# EAGLE design control-tu55 (EAGLE 5.07)

## Sheet 1 of 2
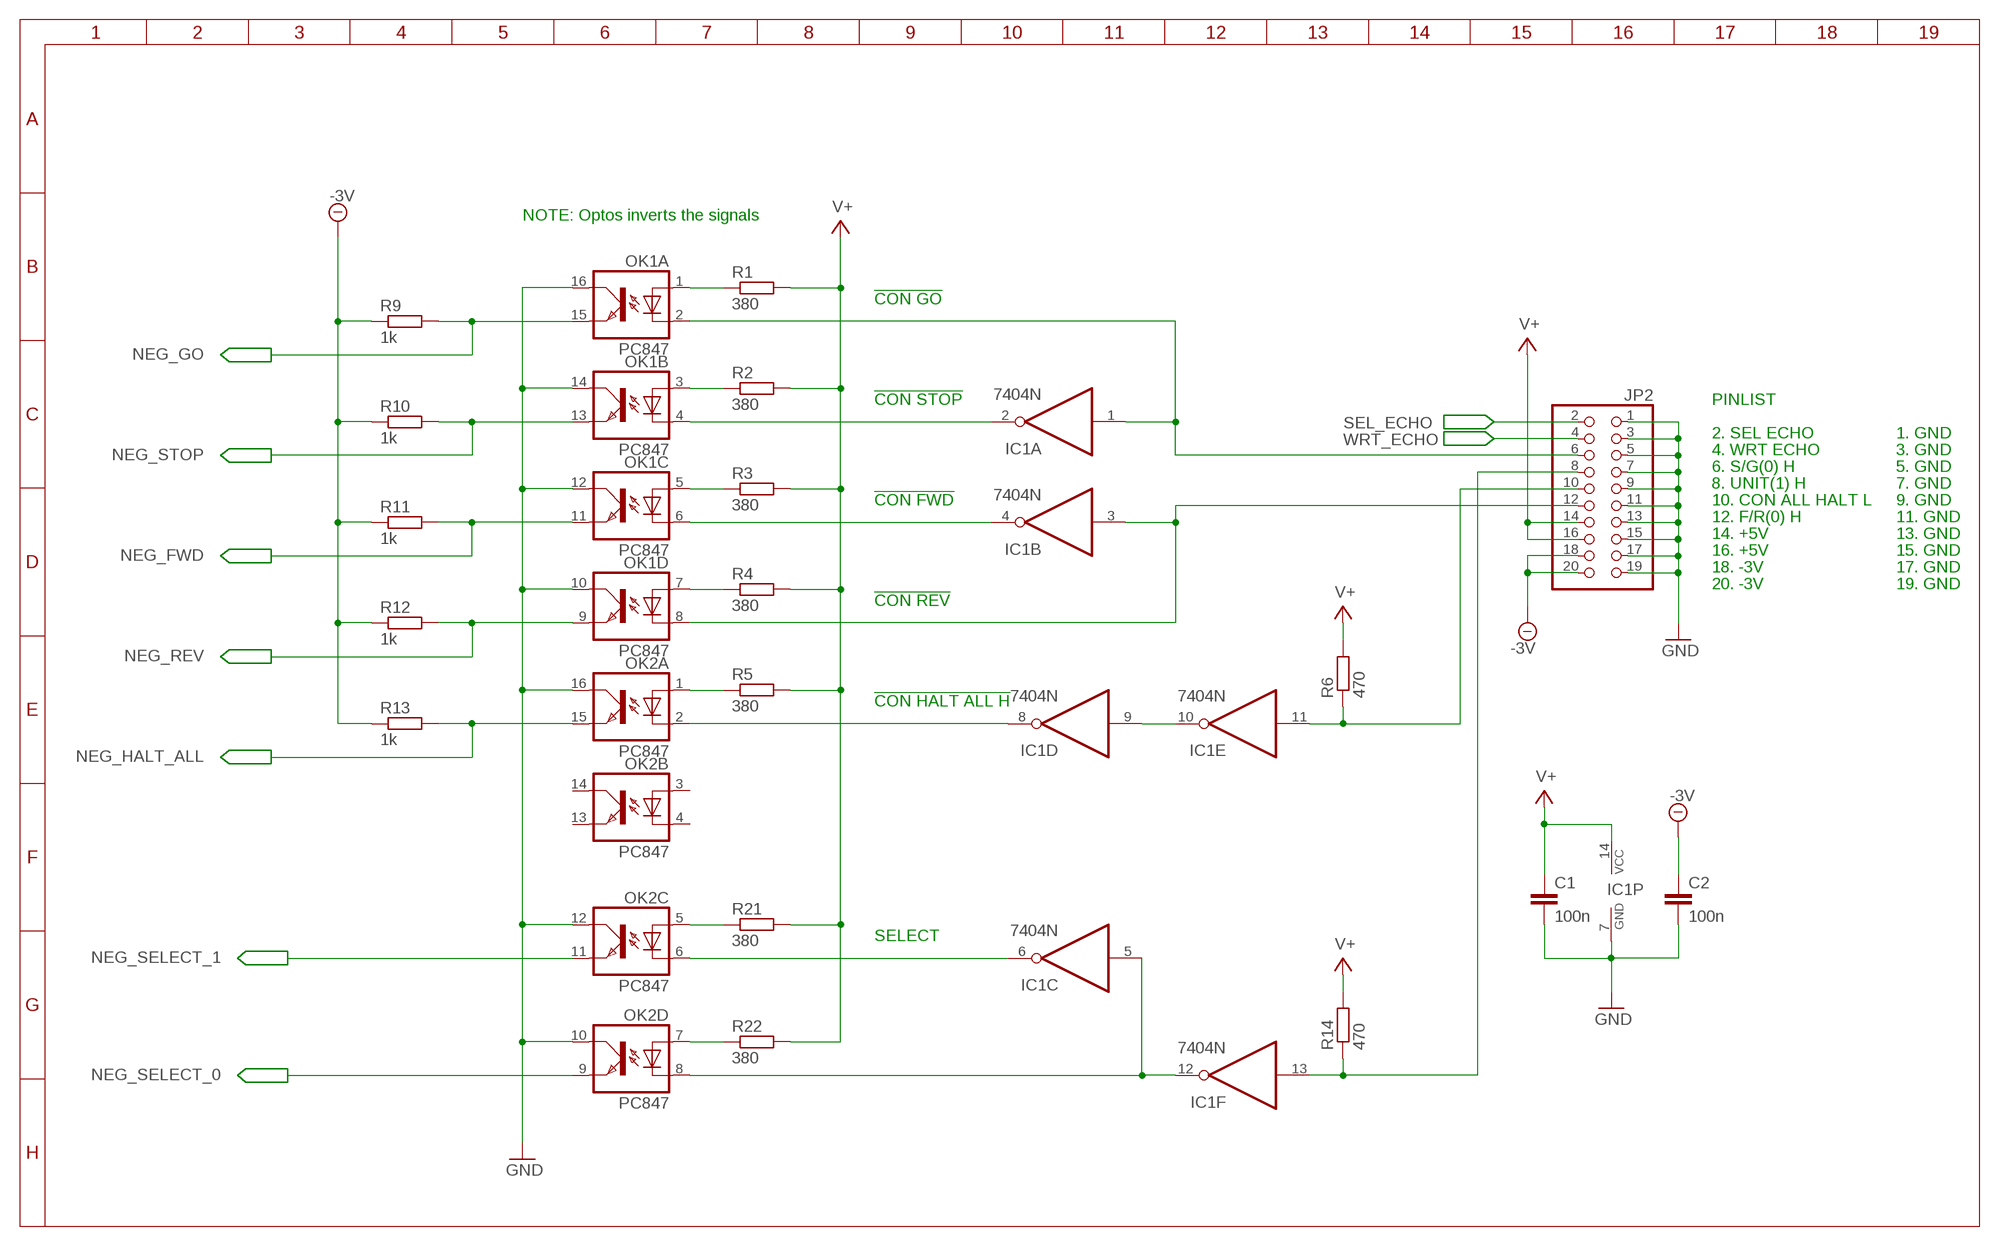
[diagram p0: schematic, sheet 1]

### Parts
C1  100n  C5/3.5  [C5B3.5]
C2  100n  C5/3.5  [C5B3.5]
IC1  7404N  [DIL14]
JP2  PINHD-2X10/90-FRAMED  [2Z10/90-FRAMED]
OK1  PC847  [DIL16]
OK2  PC847  [DIL16]
R1  380  R-EU_0207/10  [0207/10]
R2  380  R-EU_0207/10  [0207/10]
R3  380  R-EU_0207/10  [0207/10]
R4  380  R-EU_0207/10  [0207/10]
R5  380  R-EU_0207/10  [0207/10]
R6  470  R-EU_0207/10  [0207/10]
R9  1k  R-EU_0207/10  [0207/10]
R10  1k  R-EU_0207/10  [0207/10]
R11  1k  R-EU_0207/10  [0207/10]
R12  1k  R-EU_0207/10  [0207/10]
R13  1k  R-EU_0207/10  [0207/10]
R14  470  R-EU_0207/10  [0207/10]
R21  380  R-EU_0207/10  [0207/10]
R22  380  R-EU_0207/10  [0207/10]

### Nets
-3V: C2.1 JP2.18 JP2.20 R9.1 R10.1 R11.1 R12.1 R13.1 ; also sheet 2
GND: C1.2 C2.2 IC1.7(P:GND) JP2.1 JP2.3 JP2.5 JP2.7 JP2.9 JP2.11 JP2.13 JP2.15 JP2.17 JP2.19 OK1.10(D:COL) OK1.12(C:COL) OK1.14(B:COL) OK1.16(A:COL) OK2.10(D:COL) OK2.12(C:COL) OK2.16(A:COL)
N$1: IC1.9(D:I) IC1.10(E:O)
N$2: IC1.8(D:O) OK2.2(A:C)
N$3: IC1.5(C:I) IC1.12(F:O) OK2.8(D:C)
N$4: IC1.11(E:I) JP2.10 R6.1
N$10: IC1.1(A:I) JP2.6 OK1.2(A:C)
N$11: IC1.2(A:O) OK1.4(B:C)
N$15: IC1.13(F:I) JP2.8 R14.1
N$23: IC1.4(B:O) OK1.6(C:C)
N$25: OK2.5(C:A) R21.1
N$26: OK2.7(D:A) R22.1
N$27: IC1.3(B:I) JP2.12 OK1.8(D:C)
N$28: OK2.1(A:A) R5.1
N$29: OK1.7(D:A) R4.1
N$30: OK1.5(C:A) R3.1
N$31: OK1.3(B:A) R2.1
N$32: OK1.1(A:A) R1.1
N$33: IC1.6(C:O) OK2.6(C:C)
NEG_FWD: OK1.11(C:EMIT) R11.2 ; also sheet 2
NEG_GO: OK1.15(A:EMIT) R9.2 ; also sheet 2
NEG_HALT_ALL: OK2.15(A:EMIT) R13.2 ; also sheet 2
NEG_REV: OK1.9(D:EMIT) R12.2 ; also sheet 2
NEG_SELECT_0: OK2.9(D:EMIT) ; also sheet 2
NEG_SELECT_1: OK2.11(C:EMIT) ; also sheet 2
NEG_STOP: OK1.13(B:EMIT) R10.2 ; also sheet 2
SEL_ECHO: JP2.2 ; also sheet 2
V+: C1.1 IC1.14(P:VCC) JP2.14 JP2.16 R1.2 R2.2 R3.2 R4.2 R5.2 R6.2 R14.2 R21.2 R22.2
WRT_ECHO: JP2.4 ; also sheet 2
Unconnected: OK2.3(B:A) OK2.4(B:C) OK2.13(B:EMIT) OK2.14(B:COL)

### Notes on the sheet
- NOTE: Optos inverts the signals
- !CON GO
- !CON STOP | PINLIST
- 2. SEL ECHO | 1. GND
- 4. WRT ECHO | 3. GND
- 6. S/G(0) H | 5. GND
- 8. UNIT(1) H | 7. GND
- !CON FWD | 10. CON ALL HALT L | 9. GND
- 12. F/R(0) H | 11. GND
- 14. +5V | 13. GND
- 16. +5V | 15. GND
- 18. -3V | 17. GND
- 20. -3V | 19. GND
- !CON REV
- !CON HALT ALL H
- SELECT

## Sheet 2 of 2
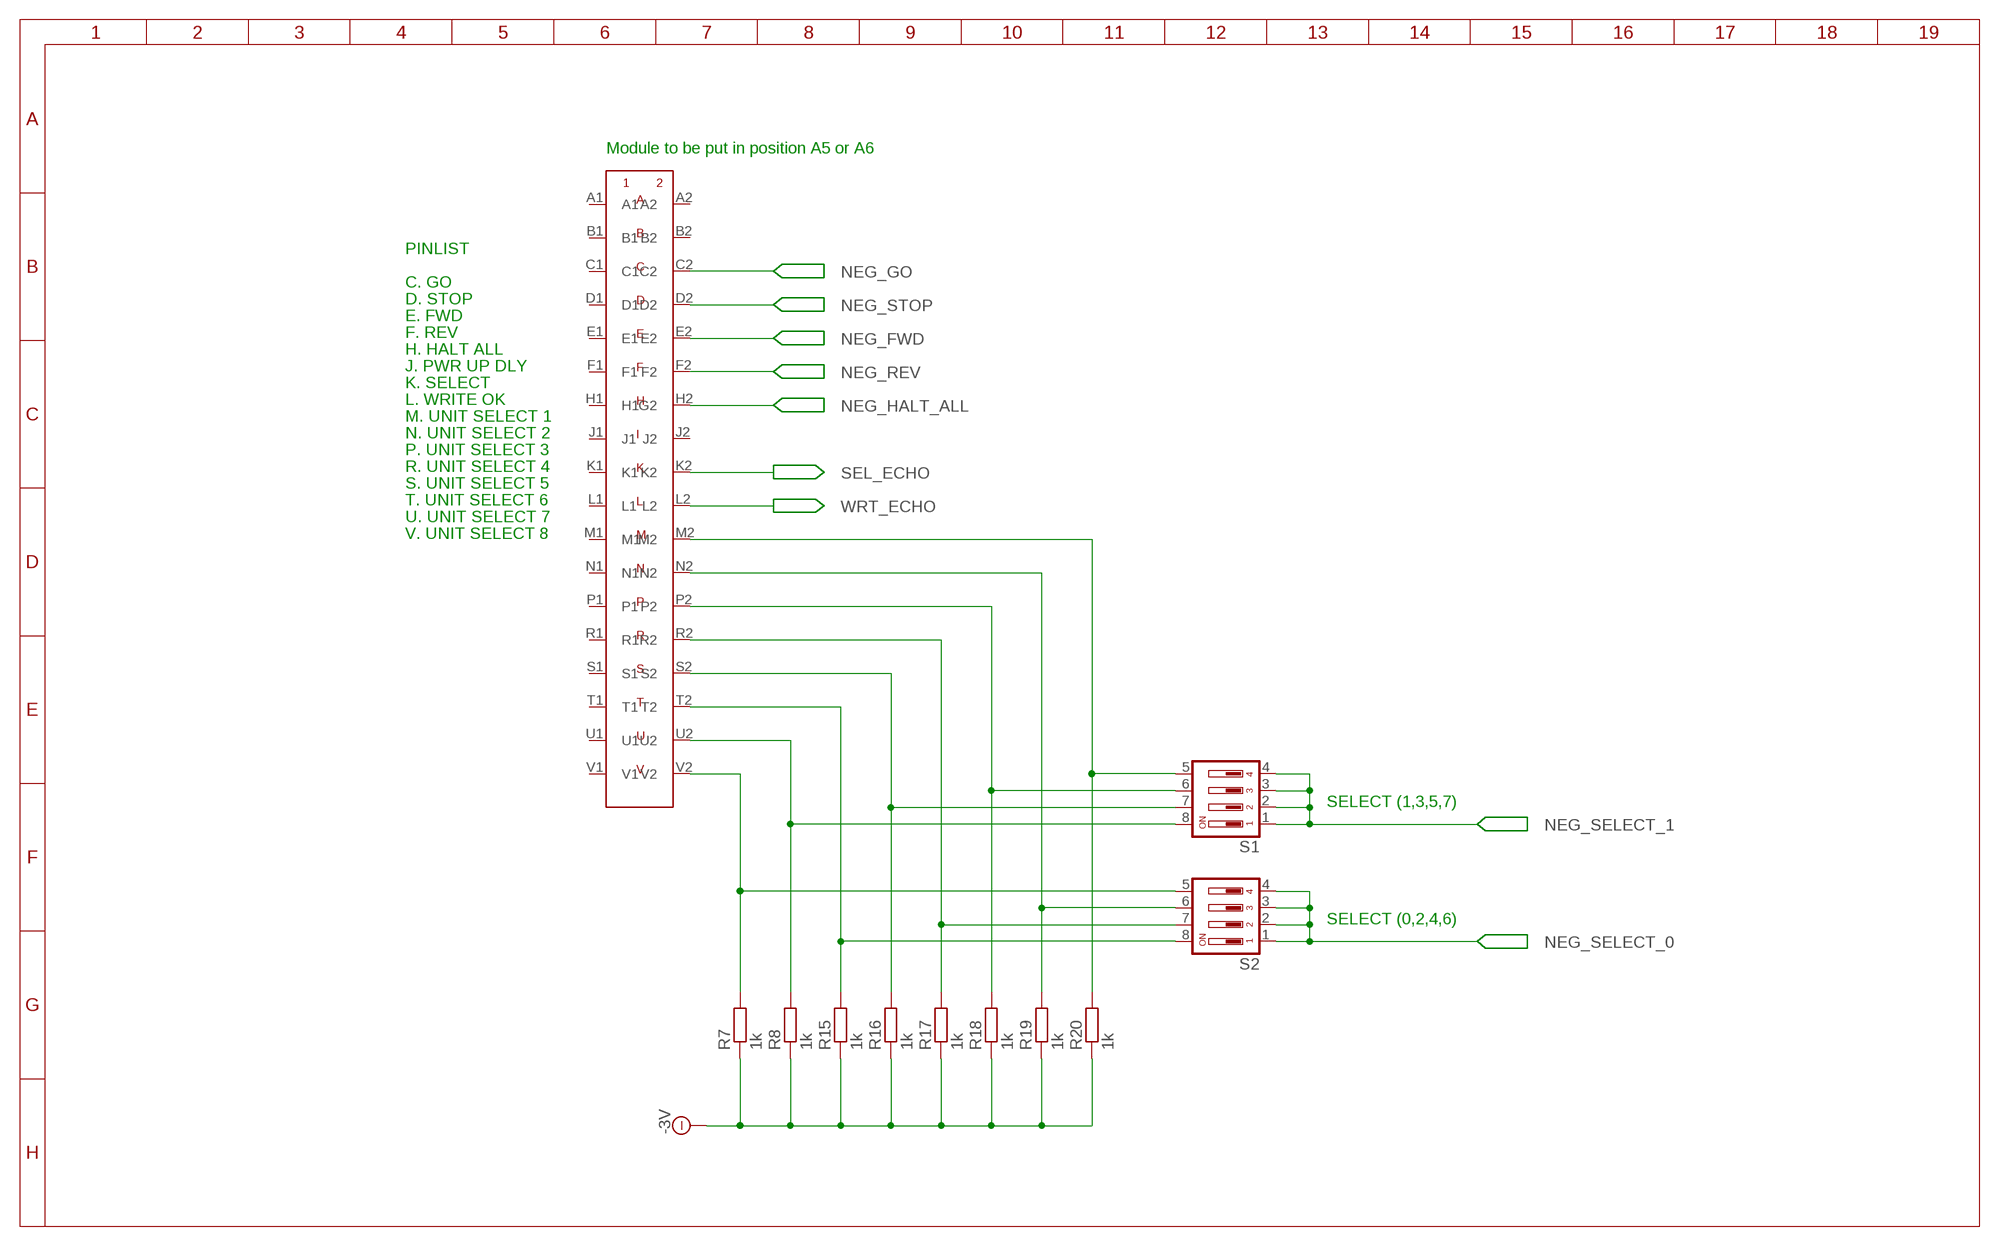
[diagram p1: schematic, sheet 2]

### Parts
CON1  FLIPCHIP_1NORMAL  [FLIPCHIP-1]
R7  1k  R-EU_0207/10  [0207/10]
R8  1k  R-EU_0207/10  [0207/10]
R15  1k  R-EU_0207/10  [0207/10]
R16  1k  R-EU_0207/10  [0207/10]
R17  1k  R-EU_0207/10  [0207/10]
R18  1k  R-EU_0207/10  [0207/10]
R19  1k  R-EU_0207/10  [0207/10]
R20  1k  R-EU_0207/10  [0207/10]
S1  DIP04YL  [DIP04YL]
S2  DIP04YL  [DIP04YL]

### Nets
-3V: R7.1 R8.1 R15.1 R16.1 R17.1 R18.1 R19.1 R20.1 ; also sheet 1
N$5: CON1.R2 R17.2 S2.7
N$6: CON1.T2 R15.2 S2.8
N$7: CON1.M2 R20.2 S1.5
N$8: CON1.V2 R7.2 S2.5
N$13: CON1.P2 R18.2 S1.6
N$14: CON1.N2 R19.2 S2.6
N$17: CON1.S2 R16.2 S1.7
N$20: CON1.U2 R8.2 S1.8
NEG_FWD: CON1.E2 ; also sheet 1
NEG_GO: CON1.C2 ; also sheet 1
NEG_HALT_ALL: CON1.H2(G2) ; also sheet 1
NEG_REV: CON1.F2 ; also sheet 1
NEG_SELECT_0: S2.1 S2.2 S2.3 S2.4 ; also sheet 1
NEG_SELECT_1: S1.1 S1.2 S1.3 S1.4 ; also sheet 1
NEG_STOP: CON1.D2 ; also sheet 1
SEL_ECHO: CON1.K2 ; also sheet 1
WRT_ECHO: CON1.L2 ; also sheet 1
Unconnected: CON1.A1 CON1.A2 CON1.B1 CON1.B2 CON1.C1 CON1.D1 CON1.E1 CON1.F1 CON1.H1 CON1.J1 CON1.J2 CON1.K1 CON1.L1 CON1.M1 CON1.N1 CON1.P1 CON1.R1 CON1.S1 CON1.T1 CON1.U1 CON1.V1

### Notes on the sheet
- Module to be put in position A5 or A6
- PINLIST
- C. GO
- D. STOP
- E. FWD
- F. REV
- H. HALT ALL
- J. PWR UP DLY
- K. SELECT
- L. WRITE OK
- M. UNIT SELECT 1
- N. UNIT SELECT 2
- P. UNIT SELECT 3
- R. UNIT SELECT 4
- S. UNIT SELECT 5
- T. UNIT SELECT 6
- U. UNIT SELECT 7
- V. UNIT SELECT 8
- SELECT (1,3,5,7)
- SELECT (0,2,4,6)

## Library data of the parts
C1 C2 = anders:C: CAPACITOR naming: grid - package width
CON1 = anders:FLIPCHIP_1: DEC Digital equipment single flipchip
IC1 = 74xx-eu:74*04: Hex INVERTER
JP2 = pinhead:PINHD-2X10: PIN HEADER
OK1 OK2 = optocoupler:PC847: SHARP OPTO COUPLER
R1-R22 = anders:R-EU_: RESISTOR, European symbol
S1 S2 = switch-dil:DIP04YL: DIL/CODE SWITCH

## Board
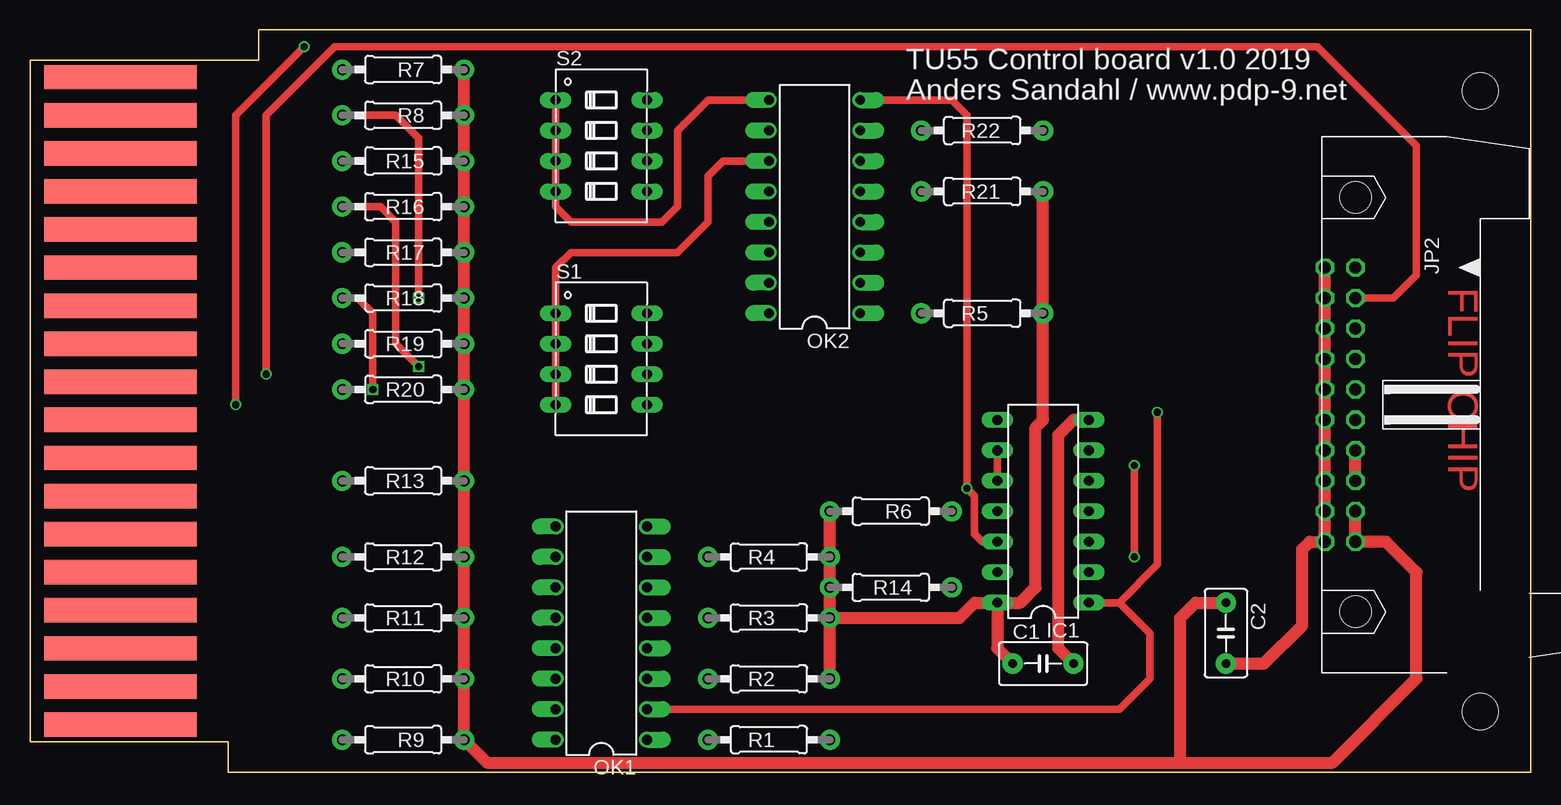
[diagram p2: board, top side]
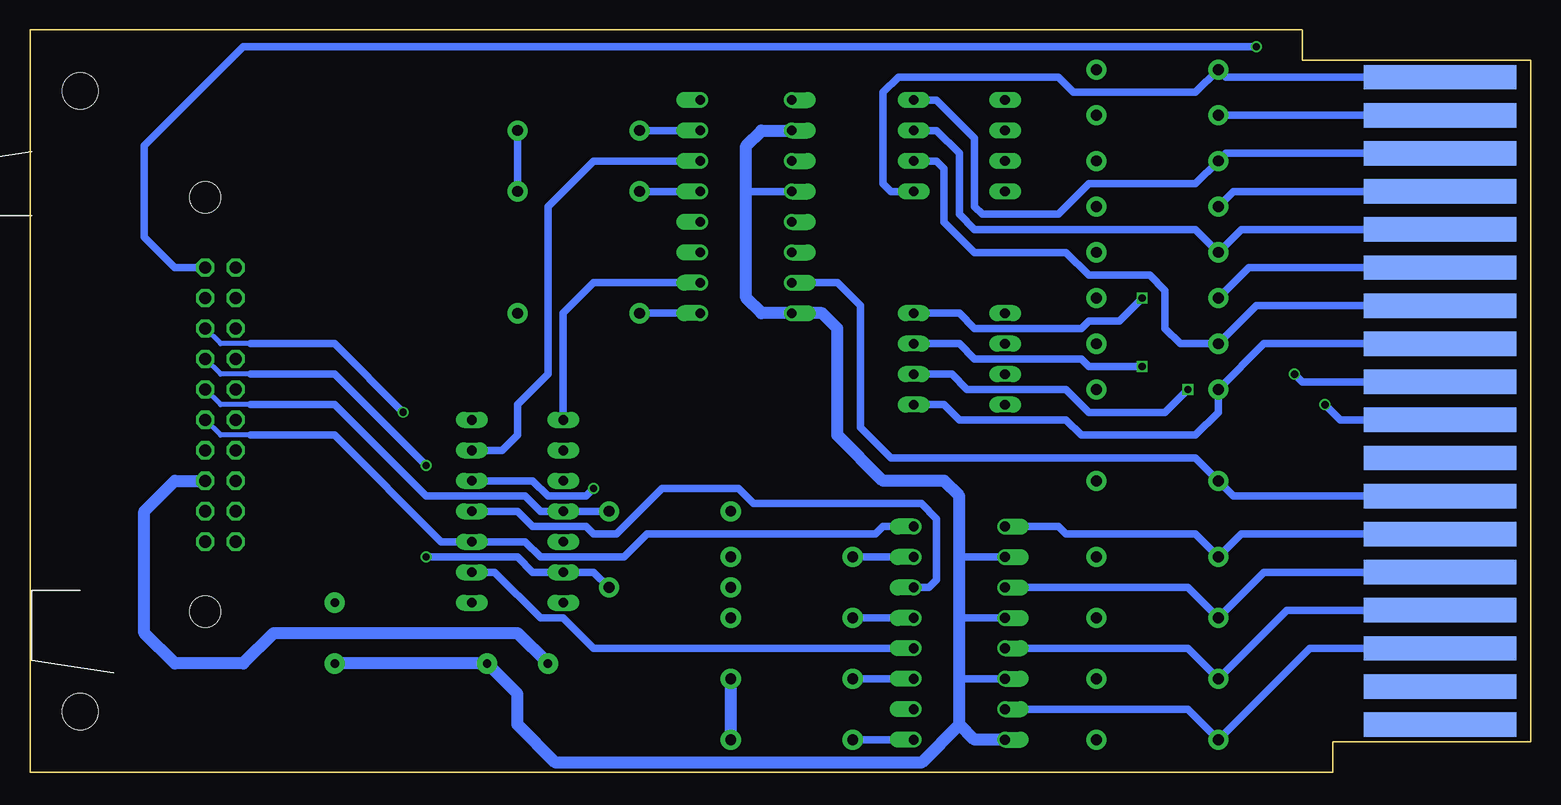
[diagram p3: board, bottom side, seen from below]

Size 125.09 x 61.91 mm. Coordinates in mm from the lower left corner, seen from the top.
Copper layers (1*16): Top 0.035mm / dielectric 1.5mm / Bottom 0.035mm
Design rules "SeeedStudio_2layer_DRU_no_angle_20140221": minimum track width 6mil, minimum drill 12mil, track to track 6mil, track to pad 6mil, pad to pad 6mil, via to via 6mil, smd to smd 0mil, copper to edge 10mil, drill to drill 10mil, minimum pad ring 10mil, minimum via ring 6mil, stop-mask expansion 2mil, vias tented up to drill 100mil, thermal gap 10mil

### Footprints (pad centres in the part's own frame; a part is rotated, then mirrored left to right if it is on the bottom)
C5B3.5 = drill 0.7 pad 1.676 round: 1 -2.54,0; 2 2.54,0
FLIPCHIP-1 = smd 12.7 x 2.032: A1 0.572,0; B1 0.572,3.175; C1 0.572,6.35; D1 0.572,9.525; E1 0.572,12.7; F1 0.572,15.875; H1 0.572,19.05; J1 0.572,22.225; K1 0.572,25.4; L1 0.572,28.575; M1 0.572,31.75; N1 0.572,34.925; P1 0.572,38.1; R1 0.572,41.275; S1 0.572,44.45; T1 0.572,47.625; U1 0.572,50.8; V1 0.572,53.975 | smd 12.7 x 2.032 bottom: A2 0.572,0; B2 0.572,3.175; C2 0.572,6.35; D2 0.572,9.525; E2 0.572,12.7; F2 0.572,15.875; H2 0.572,19.05; J2 0.572,22.225; K2 0.572,25.4; L2 0.572,28.575; M2 0.572,31.75; N2 0.572,34.925; P2 0.572,38.1; R2 0.572,41.275; S2 0.572,44.45; T2 0.572,47.625; U2 0.572,50.8; V2 0.572,53.975 | hole 3: 113.919,52.832; 113.919,1.079
DIL14 = drill 0.813 long: 1 -7.62,-3.81; 2 -5.08,-3.81; 3 -2.54,-3.81; 4 0,-3.81; 5 2.54,-3.81; 6 5.08,-3.81; 7 7.62,-3.81; 8 7.62,3.81; 9 5.08,3.81; 10 2.54,3.81; 11 0,3.81; 12 -2.54,3.81; 13 -5.08,3.81; 14 -7.62,3.81
2Z10/90-FRAMED = drill 1.016 octagon: 1 -11.43,-6.35; 2 -11.43,-3.81; 3 -8.89,-6.35; 4 -8.89,-3.81; 5 -6.35,-6.35; 6 -6.35,-3.81; 7 -3.81,-6.35; 8 -3.81,-3.81; 9 -1.27,-6.35; 10 -1.27,-3.81; 11 1.27,-6.35; 12 1.27,-3.81; 13 3.81,-6.35; 14 3.81,-3.81; 15 6.35,-6.35; 16 6.35,-3.81; 17 8.89,-6.35; 18 8.89,-3.81; 19 11.43,-6.35; 20 11.43,-3.81 | hole 2.6: 17.272,-3.81; -17.272,-3.81
DIL16 = drill 0.813 offset: 1 -8.89,-3.81; 2 -6.35,-3.81; 3 -3.81,-3.81; 4 -1.27,-3.81; 5 1.27,-3.81; 6 3.81,-3.81; 7 6.35,-3.81; 8 8.89,-3.81; 9 8.89,3.81; 10 6.35,3.81; 11 3.81,3.81; 12 1.27,3.81; 13 -1.27,3.81; 14 -3.81,3.81; 15 -6.35,3.81; 16 -8.89,3.81
0207/10 = drill 0.9 pad 1.676 round: 1 -5.08,0; 2 5.08,0
DIP04YL = drill 0.813 long: 1 -3.81,-3.81; 2 -1.27,-3.81; 3 1.27,-3.81; 4 3.81,-3.81; 5 3.81,3.81; 6 1.27,3.81; 7 -1.27,3.81; 8 -3.81,3.81

### Placement (x,y rotation side)
C1  84.45,9.08 0 top
C2  99.69,11.62 270 top
CON1  6.99,4 0 top
IC1  84.45,21.78 90 top
JP2  114.3,30.67 270 top
OK1  47.62,11.62 90 top
OK2  65.41,47.18 90 top
R1  61.59,2.73 0 top
R2  61.59,7.81 0 top
R3  61.59,12.89 0 top
R4  61.59,17.97 0 top
R5  79.38,38.29 0 top
R6  71.75,21.78 180 top
R7  31.12,58.61 180 top
R8  31.12,54.8 180 top
R9  31.12,2.73 180 top
R10  31.12,7.81 180 top
R11  31.12,12.89 180 top
R12  31.12,17.97 180 top
R13  31.12,24.32 180 top
R14  71.75,15.43 180 top
R15  31.12,50.99 180 top
R16  31.12,47.18 180 top
R17  31.12,43.37 180 top
R18  31.12,39.56 180 top
R19  31.12,35.75 180 top
R20  31.12,31.94 180 top
R21  79.38,48.45 0 top
R22  79.38,53.53 0 top
S1  47.62,34.48 270 top
S2  47.62,52.26 270 top

### Tracks (layer width: path | path; a pad name or v marks a point on that pad's centre or on a via)
-3V
  Top 0.61: R11.1 R10.1 R9.1
  Top 1.016: R7.1 R8.1 R15.1 R16.1 R17.1 R18.1 R19.1 R20.1 R13.1 R12.1 R11.1 R9.1 38.1,0.83 95.88,0.83 | 95.88,0.83 108.58,0.83 115.57,7.81 115.57,16.7 113.03,19.24 JP2.20 JP2.18 | C2.1 97.16,14.16 95.88,12.89 95.88,0.83
GND
  Top 0.61: 86.99,29.4 IC1.7
  Top 1.016: C1.2 85.72,10.35 85.72,28.13 86.99,29.4 | JP2.1 JP2.3 JP2.5 JP2.7 JP2.9 JP2.11 JP2.13 JP2.15 JP2.17 JP2.19 106.68,19.24 106.05,18.61 106.05,12.26 102.87,9.08 C2.2
  Bottom 0.61: 47.62,17.97 OK1.10 | 47.62,7.81 OK1.14 | 47.62,12.89 OK1.12 | 65.41,48.45 OK2.12
  Bottom 1.016: 47.62,4 47.62,7.81 47.62,12.89 47.62,17.97 47.62,23.05 48.9,24.32 53.98,24.32 57.79,28.13 57.79,37.02 59.05,38.29 OK2.16 64.13,38.29 65.41,39.56 65.41,48.45 65.41,52.26 64.13,53.53 OK2.10 | 47.62,4 46.36,2.73 OK1.16 | C2.2 C1.2 84.45,6.54 84.45,4 81.28,0.83 50.8,0.83 47.62,4
N$1
  Top 0.61: IC1.10 IC1.9
N$2
  Bottom 0.61: IC1.8 80.64,38.29 78.1,40.83 OK2.2
N$3  (via drill 0.6)
  Top 0.61: IC1.12 79.38,19.24 78.74,19.88 78.74,23.05 v78.1,23.69 78.1,54.8 76.83,56.07 OK2.8
  Bottom 0.61: IC1.5 83.18,24.32 81.91,23.05 78.74,23.05 v78.1,23.69
N$4
  Bottom 0.406: JP2.10 109.22,30.67 106.68,30.67 106.05,30.67
  Bottom 0.61: R6.1 IC1.11 82.55,21.78 83.82,23.05 92.07,23.05 99.69,30.67 106.68,30.67
N$5
  Bottom 0.61: CON1.R2 24.13,45.28 R17.2 27.94,45.28 46.36,45.28 47.62,46.55 47.62,51.63 49.53,53.53 S2.7
N$6
  Bottom 0.61: CON1.T2 25.4,51.63 R15.2 27.94,49.09 36.83,49.09 39.37,46.55 45.72,46.55 46.36,47.18 46.36,52.9 49.53,56.07 S2.8
N$7
  Bottom 0.61: CON1.M2 22.23,35.75 R20.2 26.04,30.04 27.94,28.13 37.47,28.13 38.73,29.4 47.62,29.4 48.9,30.67 S1.5
N$8
  Bottom 0.61: CON1.V2 25.4,57.98 R7.2 27.94,56.71 38.1,56.71 39.37,57.98 52.71,57.98 53.98,56.71 53.98,49.09 53.34,48.45 S2.5
N$10  (via drill 0.6)
  Top 0.61: OK1.2 90.8,5.27 93.34,7.81 93.34,11.62 90.8,14.16 | 90.8,14.16 IC1.1 | 90.8,14.16 93.98,17.34 v93.98,30.04
  Bottom 0.406: JP2.6 109.22,35.75 106.68,35.75 106.05,35.75
  Bottom 0.61: v93.98,30.04 99.69,35.75 106.68,35.75
N$11
  Bottom 0.61: OK1.4 78.1,10.35 80.64,12.89 82.55,12.89 86.36,16.7 IC1.2
N$13  (via drill 0.6)
  Top 0.61: v28.58,31.94 28.58,38.29 27.3,39.56 R18.2
  Bottom 0.61: CON1.P2 23.49,42.1 R18.2 | S1.6 48.26,33.21 46.99,31.94 38.73,31.94 36.83,30.04 30.48,30.04 v28.58,31.94
N$14
  Bottom 0.61: CON1.N2 22.86,38.93 R19.2 29.21,35.75 30.48,37.02 30.48,40.2 31.75,41.47 36.83,41.47 38.73,43.37 46.36,43.37 48.9,45.91 48.9,50.36 49.53,50.99 S2.6
N$15  (via drill 0.6)
  Top 0.61: v92.07,17.97 v92.07,25.59
  Bottom 0.406: JP2.8 109.22,33.21 106.68,33.21 106.05,33.21
  Bottom 0.61: 106.68,33.21 99.69,33.21 v92.07,25.59 | v92.07,17.97 84.45,17.97 83.18,16.7 IC1.13 78.1,16.7 R14.1
N$17  (via drill 0.6)
  Top 0.61: R16.2 29.21,47.18 30.48,45.91 30.48,35.75 v32.39,33.85
  Bottom 0.61: CON1.S2 24.77,48.45 R16.2 | S1.7 47.62,35.75 46.36,34.48 37.47,34.48 36.83,33.85 33.66,33.85 v32.39,33.85
N$20  (via drill 0.6)
  Top 0.61: v32.39,39.56 32.39,52.9 30.48,54.8 R8.2
  Bottom 0.61: CON1.U2 R8.2 | S1.8 47.62,38.29 46.36,37.02 37.47,37.02 36.83,37.66 34.29,37.66 v32.39,39.56
N$23
  Bottom 0.61: IC1.4 84.45,21.78 83.18,20.51 78.74,20.51 78.1,19.88 76.2,19.88 72.39,23.69 66.04,23.69 64.77,22.42 50.8,22.42 49.53,21.15 49.53,16.07 50.16,15.43 OK1.6
N$25
  Bottom 0.61: OK2.5 R21.1
N$26
  Bottom 0.61: OK2.7 R22.1
N$27
  Bottom 0.406: JP2.12 109.22,28.13 106.68,28.13 106.05,28.13
  Bottom 0.61: OK1.8 53.98,20.51 54.61,19.88 73.66,19.88 75.56,17.97 82.55,17.97 83.82,19.24 IC1.3 90.8,19.24 99.69,28.13 106.68,28.13
N$28
  Bottom 0.61: OK2.1 R5.1
N$29
  Bottom 0.61: OK1.7 R4.1
N$30
  Bottom 0.61: OK1.5 R3.1
N$31
  Bottom 0.61: OK1.3 R2.1
N$32
  Bottom 0.61: OK1.1 R1.1
N$33
  Bottom 0.61: OK2.6 78.1,50.99 81.91,47.18 81.91,33.21 84.45,30.67 84.45,28.13 85.72,26.86 IC1.6
NEG_FWD
  Bottom 0.61: CON1.E2 22.23,16.7 R11.2 28.58,15.43 OK1.11
NEG_GO
  Bottom 0.61: CON1.C2 18.41,10.35 R9.2 28.58,5.27 OK1.15
NEG_HALT_ALL
  Bottom 0.61: CON1.H2 24.77,23.05 R13.2 27.94,26.23 53.34,26.23 55.88,28.77 55.88,38.93 57.79,40.83 OK2.15
NEG_REV
  Bottom 0.61: CON1.F2 24.13,19.88 R12.2 27.94,19.88 38.73,19.88 39.37,20.51 OK1.9
NEG_SELECT_0
  Top 0.61: S2.1 S2.2 S2.3 S2.4 43.82,47.18 45.09,45.91 52.71,45.91 53.98,47.18 53.98,53.53 56.52,56.07 OK2.9
NEG_SELECT_1
  Top 0.61: S1.4 S1.3 S1.2 S1.1 43.82,42.1 45.09,43.37 53.98,43.37 56.52,45.91 56.52,49.72 57.79,50.99 OK2.11
NEG_STOP
  Bottom 0.61: CON1.D2 20.32,13.53 R10.2 28.58,10.35 OK1.13
SEL_ECHO  (via drill 0.6)
  Top 0.61: v17.15,30.67 17.15,54.8 v22.86,60.52
  Bottom 0.61: CON1.K2 15.88,29.4 v17.15,30.67 | JP2.2 113.03,42.1 115.57,44.64 115.57,52.26 107.31,60.52 v22.86,60.52
V+
  Top 1.016: R2.2 R3.2 | R3.2 R14.2 R4.2 R6.2 | JP2.16 JP2.14 | IC1.14 80.64,10.35 C1.1 | R21.2 R5.2 84.45,29.4 83.82,28.77 83.82,15.43 82.55,14.16 IC1.14 | IC1.14 78.74,14.16 77.47,12.89 R3.2
  Bottom 0.61: R21.2 R22.2
  Bottom 1.016: R1.2 R2.2 | C1.1 84.45,11.62 104.77,11.62 107.31,9.08 113.03,9.08 115.57,11.62 115.57,21.78 113.03,24.32 JP2.16
WRT_ECHO  (via drill 0.6)
  Top 0.61: v19.69,33.21 19.69,54.8 25.4,60.52 107.31,60.52 115.57,52.26 115.57,41.47 113.66,39.56 JP2.4
  Bottom 0.61: CON1.L2 19.05,32.58 v19.69,33.21

### Text on the board
tNames: TU55 Control board v1.0 2019 | Anders Sandahl / www.pdp-9.net
tDocu: 6 | 4 | 2 | 0 (8) | 7 | 5 | 3 | 1